# EAGLE design Pressure_module (EAGLE 9.6.2)
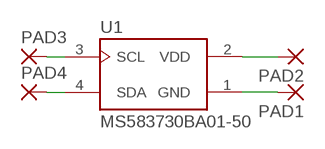
[diagram p0: schematic, sheet 1]

## Parts
PAD1  1,6/0,8  [1,6/0,8]
PAD2  1,6/0,8  [1,6/0,8]
PAD3  1,6/0,8  [1,6/0,8]
PAD4  1,6/0,8  [1,6/0,8]
U1  MS583730BA01-50  [TE_MS583730BA01-50]

## Nets
N$1: PAD3.1(P) U1.3(SCL)
N$2: PAD4.1(P) U1.4(SDA)
N$3: PAD2.1(P) U1.2(VDD)
N$4: PAD1.1(P) U1.1(GND)

## Library data of the parts
PAD1-PAD4 = wirepad:1,6/0,8: THROUGH-HOLE PAD
U1 = MS583730BA01-50:MS583730BA01-50: SENSOR PRESSURE UNDERWATER; COMMENT: MS583730BA01-50; DESCRIPTION: Waterproof Digital Pressure Ms583730ba01-50; DIGI-KEY_PART_NUMBER: 223-1704-1-ND; DIGIKEY-PURCHASE-URL: https://snapeda.com/shop?store=DigiKey&id=566080; MF: TE Connectivity; MOUSER-PURCHASE-URL: https://snapeda.com/shop?store=Mouser&id=566080; MP: MS583730BA01-50; PACKAGE: SMD-4 TE Connectivity ALCOSWITCH Switches

## Board
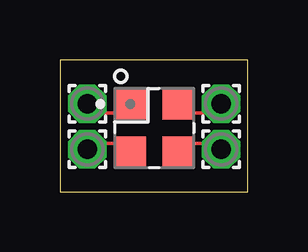
[diagram p1: board, top side]

Size 7.85 x 5.51 mm. Coordinates in mm from the lower left corner, seen from the top.
Outline: 0,0 7.85,0 7.85,5.51 0,5.51 0,0
Copper layers (1*16): Top 0.035mm / dielectric 1.5mm / Bottom 0.035mm
Design rules "default": minimum track width 6mil, minimum drill 0.35mm, track to track 6mil, track to pad 6mil, pad to pad 6mil, via to via 6mil, smd to smd 6mil, copper to edge 40mil, drill to drill 6mil, minimum pad ring 10mil, minimum via ring 8mil, stop-mask expansion 4mil, vias tented up to drill 0mil, thermal gap 10mil

### Footprints (pad centres in the part's own frame; a part is rotated, then mirrored left to right if it is on the bottom)
1,6/0,8 = drill 0.813 pad 1.6 octagon: 1 0,0
TE_MS583730BA01-50 = smd 1.3 x 1.3: 1 -1,1; 2 -1,-1; 3 1,-1; 4 1,1

### Placement (x,y rotation side)
PAD1  1.14,3.68 0 top
PAD2  1.14,1.78 0 top
PAD3  6.73,1.78 0 top
PAD4  6.73,3.68 0 top
U1  3.94,2.67 0 top

### Tracks (layer width: path | path; a pad name or v marks a point on that pad's centre or on a via)
N$1
  Top 0.152: U1.3 5.08,2.03 6.35,2.03 PAD3.1
N$2
  Top 0.152: U1.4 5.08,3.3 6.35,3.3 PAD4.1
N$3
  Top 0.152: U1.2 2.54,2.03 1.27,2.03 PAD2.1
N$4
  Top 0.152: U1.1 2.54,3.3 1.27,3.3 PAD1.1